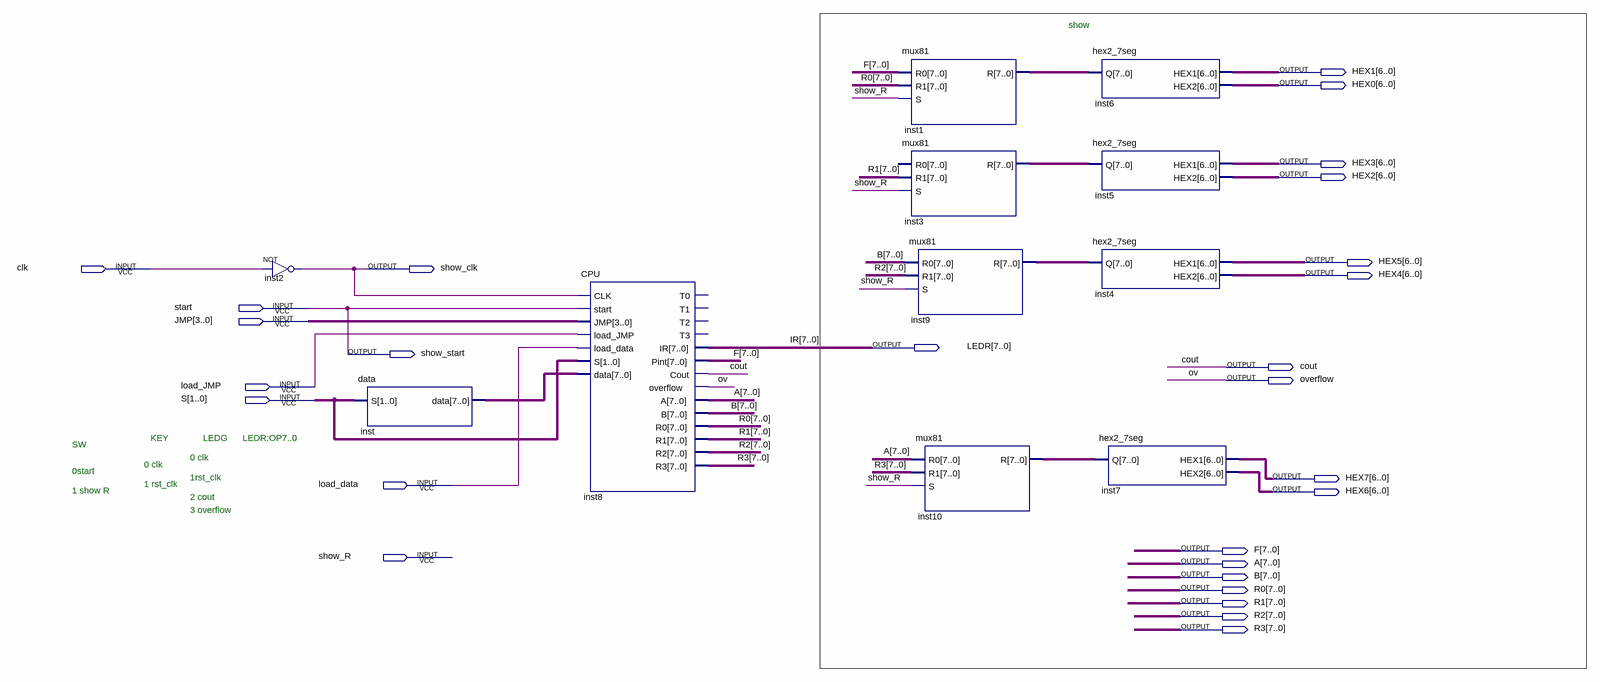
[diagram p0: schematic sheet]
// Quartus schematic CPU_e2.bdf as structural Verilog: 11 symbols, 27 pins
module CPU_e2 (
  input  clk,
  input  start,
  input  [3:0] JMP,
  input  load_JMP,
  input  [1:0] S,
  input  load_data,
  input  show_R,
  output [6:0] HEX1,
  output [6:0] HEX0,
  output [6:0] HEX3,
  output [6:0] HEX2,
  output [6:0] HEX5,
  output show_clk,
  output [6:0] HEX4,
  output [7:0] LEDR,
  output show_start,
  output cout,
  output overflow,
  output [6:0] HEX7,
  output [6:0] HEX6,
  output [7:0] F,
  output [7:0] A,
  output [7:0] B,
  output [7:0] R0,
  output [7:0] R1,
  output [7:0] R2,
  output [7:0] R3
);

  wire [7:0] inst1_r, inst3_r, inst9_r, inst10_r, inst_data;

  not inst2 (show_clk, clk);
  data inst (.S(S), .data(inst_data));
  CPU inst8 (
    .CLK(show_clk), .start(start), .JMP(JMP), .load_JMP(load_JMP), .load_data(load_data), .S(S),
    .data(inst_data), .IR(LEDR), .Pint(F), .Cout(cout), .overflow(overflow), .A(A), .B(B), .R0(R0), .R1(R1),
    .R2(R2), .R3(R3));  // open: T0, T1, T2, T3
  mux81 inst1 (.R0(F), .R1(R0), .S(show_R), .R(inst1_r));
  mux81 inst3 (.R1(R1), .S(show_R), .R(inst3_r));  // open: R0
  mux81 inst9 (.R0(B), .R1(R2), .S(show_R), .R(inst9_r));
  mux81 inst10 (.R0(A), .R1(R3), .S(show_R), .R(inst10_r));
  hex2_7seg inst6 (.Q(inst1_r), .HEX1(HEX1), .HEX2(HEX0));
  hex2_7seg inst5 (.Q(inst3_r), .HEX1(HEX3), .HEX2(HEX2));
  hex2_7seg inst4 (.Q(inst9_r), .HEX1(HEX5), .HEX2(HEX4));
  hex2_7seg inst7 (.Q(inst10_r), .HEX1(HEX7), .HEX2(HEX6));

  assign show_start = start;

  // Other names for the same wires on the sheet: IR[7:0] = LEDR; ov = overflow

  // Notes on the sheet:
  //   show
  //   KEY
  //   LEDG
  //   LEDR:OP7..0
  //   SW
  //   0 clk
  //   0 clk
  //   0start
  //   1rst_clk
  //   1 rst_clk
  //   1 show R
  //   2 cout
  //   3 overflow
endmodule
